# Altium schematic sheet mx8m_pmic.SchDoc (part 1 of 3)
size A2; SheetNumber: 3; SheetTotal: 15
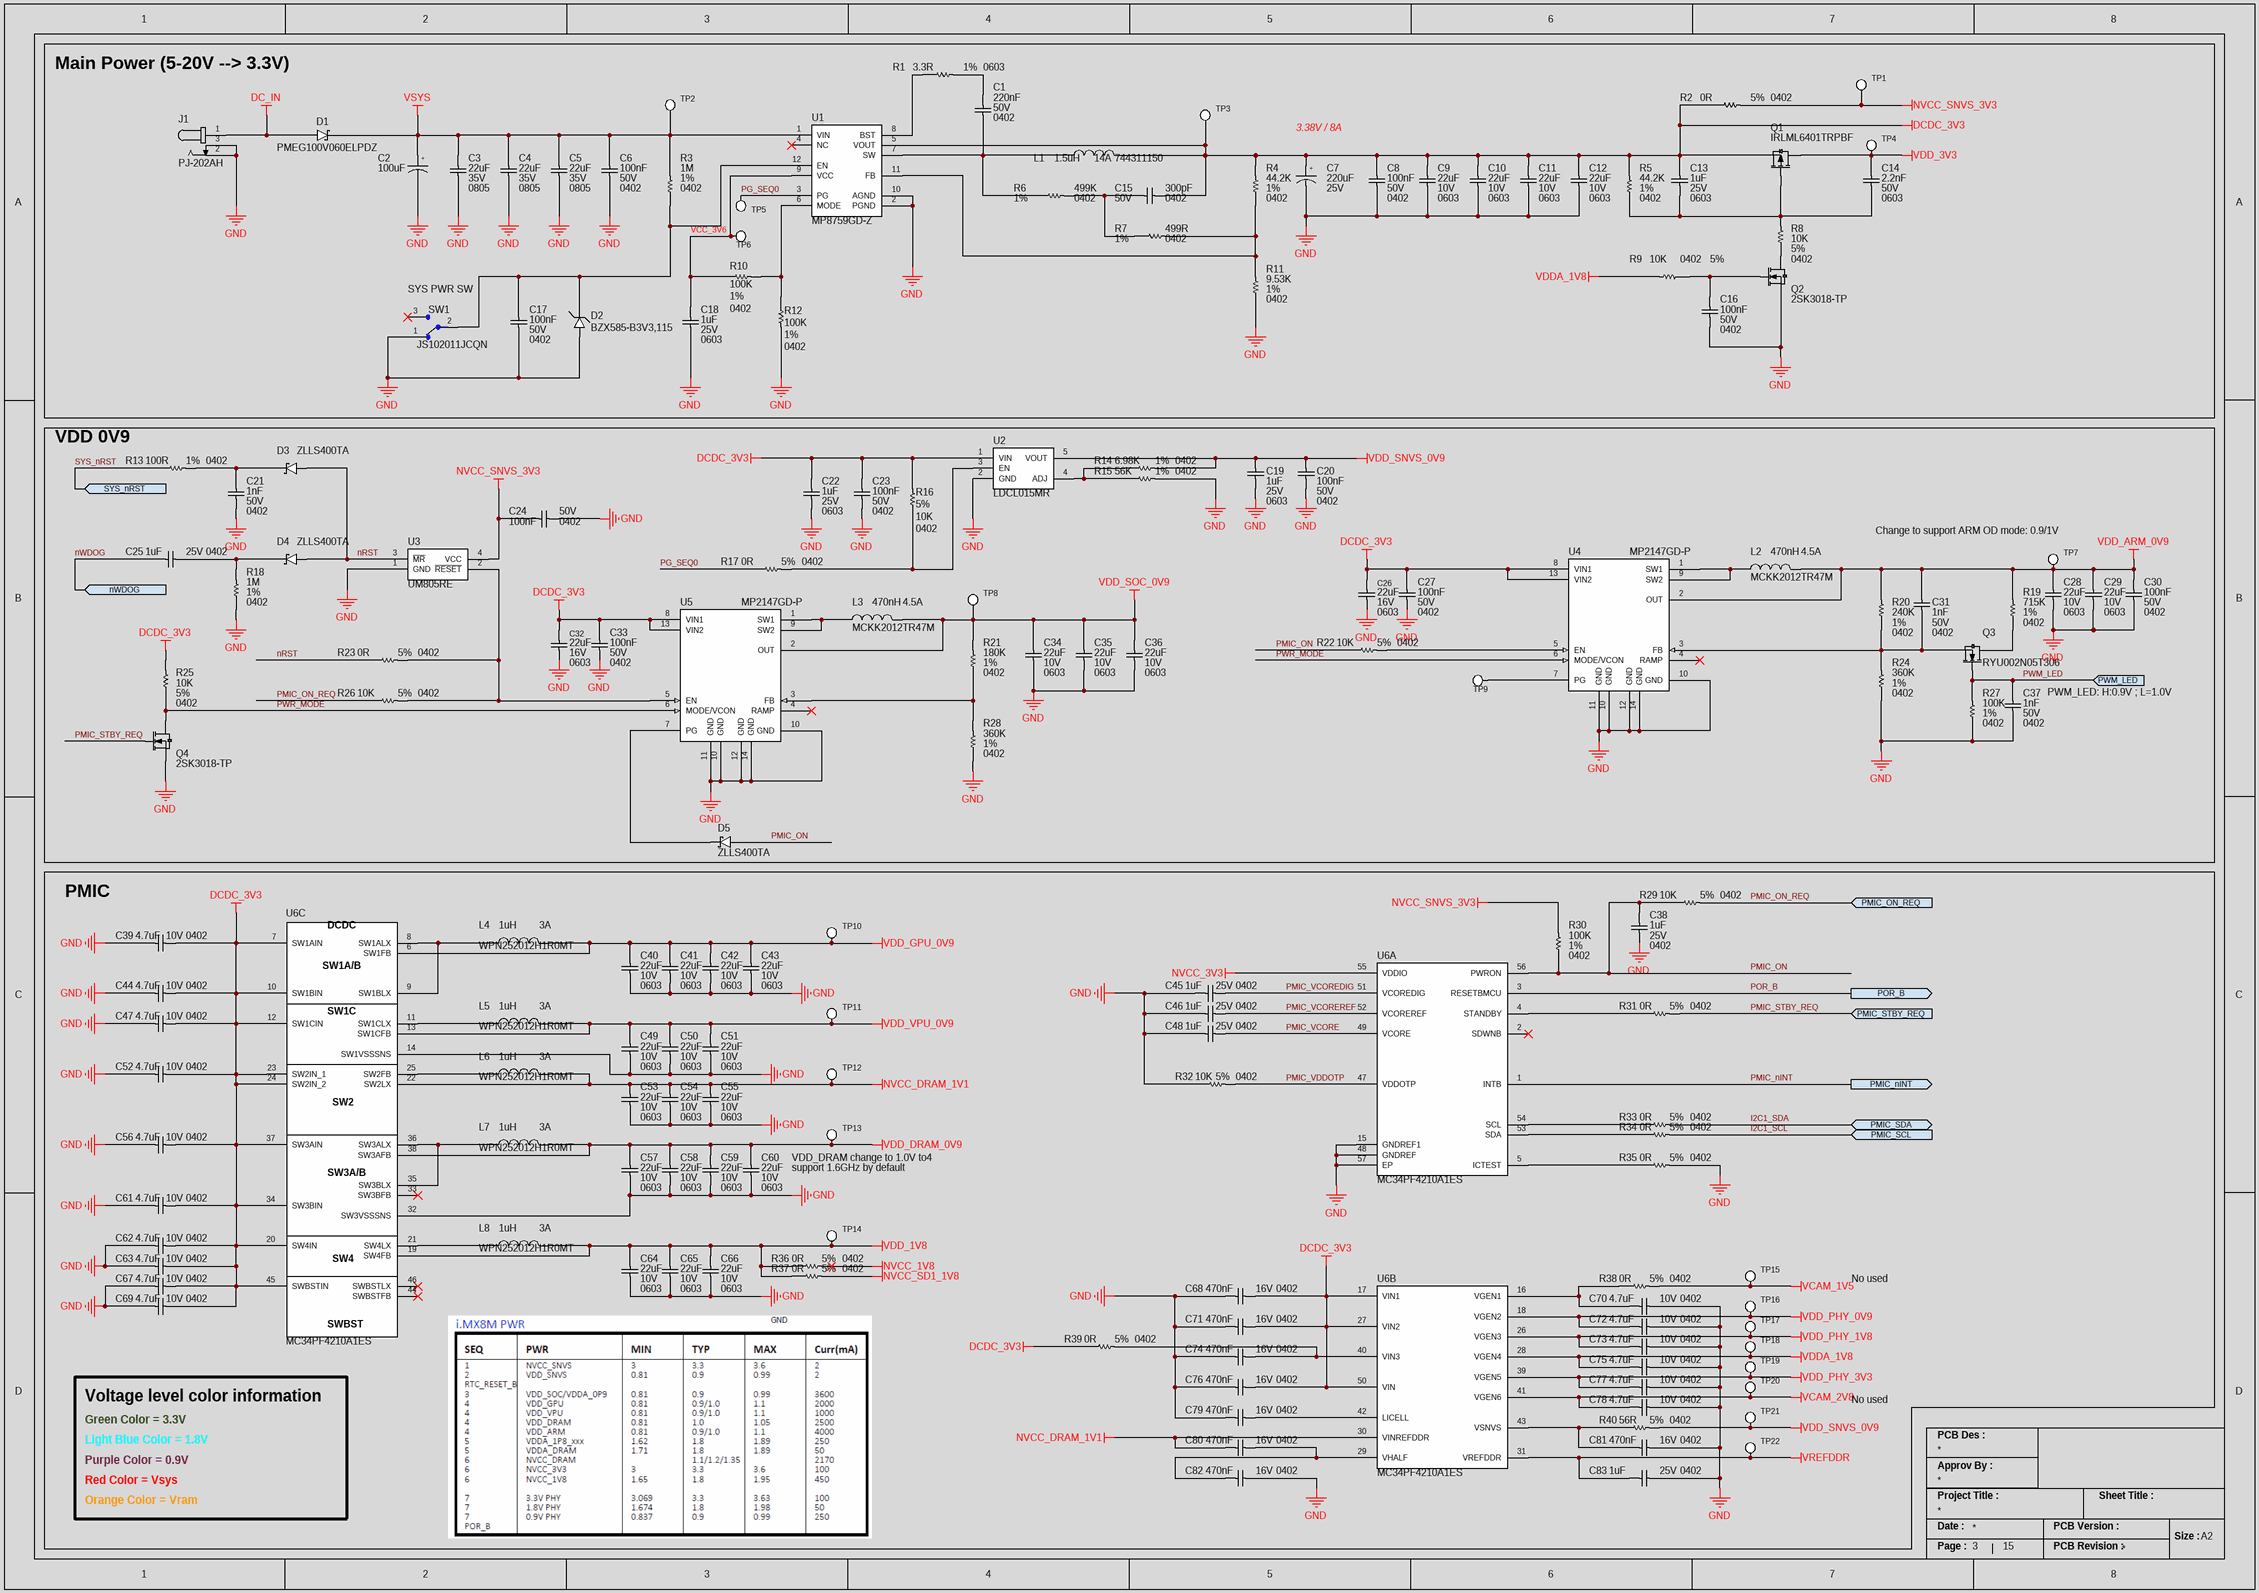
[diagram p0: mx8m_pmic.SchDoc]

## Parts
C1  Case/Package: 0402  Voltage Rating (DC): 50V  Capacitance: 220nF  [CAP_0402_CAPC1005X05N]  (hidden comment: GRM155R61H224KE01W)
C2  Capacitance: 100uF  [CAP_POLA_UD(8X10)]  (hidden comment: UUD1H101MNL1GS)
C3  Voltage rated: 35V  Case package: 0805  Capacitance: 22uF  [CAP_0805_CAPC2012X12N]  (hidden comment: C2012X5R1V226M125DC)
C4  Voltage rated: 35V  Case package: 0805  Capacitance: 22uF  [CAP_0805_CAPC2012X12N]  (hidden comment: C2012X5R1V226M125DC)
C5  Voltage rated: 35V  Case package: 0805  Capacitance: 22uF  [CAP_0805_CAPC2012X12N]  (hidden comment: C2012X5R1V226M125DC)
C6  Voltage Rating: 50V  Capacitance: 100nF  Case/Package: 0402  [CAP_0402_CAPC1005X05N]  (hidden comment: GRM155R71H104KE14D)
C7  Voltage Rating: 25V  Capacitance: 220uF  [CAP_POL_220uF_CAPAE830X1050N]  (hidden comment: EEV227M025A9MAA)
C8  Voltage Rating: 50V  Capacitance: 100nF  Case/Package: 0402  [CAP_0402_CAPC1005X05N]  (hidden comment: GRM155R71H104KE14D)
C9  Capacitance: 22uF  Voltage Rating: 10V  Case Code (Imperial): 0603  [CAP_0603_CAPC1608X08N]  (hidden comment: C1608X5R1A226M080AC)
C10  Capacitance: 22uF  Voltage Rating: 10V  Case Code (Imperial): 0603  [CAP_0603_CAPC1608X08N]  (hidden comment: C1608X5R1A226M080AC)
C11  Capacitance: 22uF  Voltage Rating: 10V  Case Code (Imperial): 0603  [CAP_0603_CAPC1608X08N]  (hidden comment: C1608X5R1A226M080AC)
C12  Capacitance: 22uF  Voltage Rating: 10V  Case Code (Imperial): 0603  [CAP_0603_CAPC1608X08N]  (hidden comment: C1608X5R1A226M080AC)
C13  Voltage Rating: 25V  Capacitance: 1uF  Case/Package: 0603  [CAP_0603_CAPC1608X08N]  (hidden comment: GCM188R71E105KA64D)
C14  Case/Package: 0603  Voltage Rating: 50V  Capacitance: 2.2nF  [CAP_0603_CAPC1608X08N]  (hidden comment: GRM1885C1H222JA01D)
C15  Case Code (Imperial): 0402  Voltage Rating: 50V  Capacitance: 300pF  [CAP_0402_CAPC1005X05N]  (hidden comment: GCM1555C1H301JA16D)
C16  Voltage Rating: 50V  Capacitance: 100nF  Case/Package: 0402  [CAP_0402_CAPC1005X05N]  (hidden comment: GRM155R71H104KE14D)
C17  Voltage Rating: 50V  Capacitance: 100nF  Case/Package: 0402  [CAP_0402_CAPC1005X05N]  (hidden comment: GRM155R71H104KE14D)
C18  Voltage Rating: 25V  Capacitance: 1uF  Case/Package: 0603  [CAP_0603_CAPC1608X08N]  (hidden comment: GCM188R71E105KA64D)
C19  Voltage Rating: 25V  Capacitance: 1uF  Case/Package: 0603  [CAP_0603_CAPC1608X08N]  (hidden comment: GCM188R71E105KA64D)
C20  Voltage Rating: 50V  Capacitance: 100nF  Case/Package: 0402  [CAP_0402_CAPC1005X05N]  (hidden comment: GRM155R71H104KE14D)
C21  Voltage Rating: 50V  Capacitance: 1nF  Case Code (Imperial): 0402  [CAP_0402_CAPC1005X05N]  (hidden comment: GRM1555C1H102JA01D)
C22  Voltage Rating: 25V  Capacitance: 1uF  Case/Package: 0603  [CAP_0603_CAPC1608X08N]  (hidden comment: GCM188R71E105KA64D)
C23  Voltage Rating: 50V  Capacitance: 100nF  Case/Package: 0402  [CAP_0402_CAPC1005X05N]  (hidden comment: GRM155R71H104KE14D)
C24  Voltage Rating: 50V  Capacitance: 100nF  Case/Package: 0402  [CAP_0402_CAPC1005X05N]  (hidden comment: GRM155R71H104KE14D)
C25  Voltage Rating: 25V  Capacitance: 1uF  Case Code (Imperial): 0402  [CAP_0402_CAPC1005X05N]  (hidden comment: GRM155R61E105KA12D)
C26  Capacitance: 22uF  Voltage Rating: 16V  Case/Package: 0603  [CAP_0603_CAPC1608X08N]  (hidden comment: CL10A226MO7JZNC)
C27  Voltage Rating: 50V  Capacitance: 100nF  Case/Package: 0402  [CAP_0402_CAPC1005X05N]  (hidden comment: GRM155R71H104KE14D)
C28  Capacitance: 22uF  Voltage Rating: 10V  Case Code (Imperial): 0603  [CAP_0603_CAPC1608X08N]  (hidden comment: C1608X5R1A226M080AC)
C29  Capacitance: 22uF  Voltage Rating: 10V  Case Code (Imperial): 0603  [CAP_0603_CAPC1608X08N]  (hidden comment: C1608X5R1A226M080AC)
C30  Voltage Rating: 50V  Capacitance: 100nF  Case/Package: 0402  [CAP_0402_CAPC1005X05N]  (hidden comment: GRM155R71H104KE14D)
C31  Voltage Rating: 50V  Capacitance: 1nF  Case Code (Imperial): 0402  [CAP_0402_CAPC1005X05N]  (hidden comment: GRM1555C1H102JA01D)
C32  Capacitance: 22uF  Voltage Rating: 16V  Case/Package: 0603  [CAP_0603_CAPC1608X08N]  (hidden comment: CL10A226MO7JZNC)
C33  Voltage Rating: 50V  Capacitance: 100nF  Case/Package: 0402  [CAP_0402_CAPC1005X05N]  (hidden comment: GRM155R71H104KE14D)
C34  Capacitance: 22uF  Voltage Rating: 10V  Case Code (Imperial): 0603  [CAP_0603_CAPC1608X08N]  (hidden comment: C1608X5R1A226M080AC)
C35  Capacitance: 22uF  Voltage Rating: 10V  Case Code (Imperial): 0603  [CAP_0603_CAPC1608X08N]  (hidden comment: C1608X5R1A226M080AC)
C36  Capacitance: 22uF  Voltage Rating: 10V  Case Code (Imperial): 0603  [CAP_0603_CAPC1608X08N]  (hidden comment: C1608X5R1A226M080AC)
C37  Voltage Rating: 50V  Capacitance: 1nF  Case Code (Imperial): 0402  [CAP_0402_CAPC1005X05N]  (hidden comment: GRM1555C1H102JA01D)
C38  Voltage Rating: 25V  Capacitance: 1uF  Case Code (Imperial): 0402  [CAP_0402_CAPC1005X05N]  (hidden comment: GRM155R61E105KA12D)
C39  Capacitance: 4.7uF  Voltage Rating: 10V  Case/Package: 0402  [CAP_0402_CAPC1005X05N]  (hidden comment: CL05A475KP5NRNC)
C40  Capacitance: 22uF  Voltage Rating: 10V  Case Code (Imperial): 0603  [CAP_0603_CAPC1608X08N]  (hidden comment: C1608X5R1A226M080AC)
C41  Capacitance: 22uF  Voltage Rating: 10V  Case Code (Imperial): 0603  [CAP_0603_CAPC1608X08N]  (hidden comment: C1608X5R1A226M080AC)
C42  Capacitance: 22uF  Voltage Rating: 10V  Case Code (Imperial): 0603  [CAP_0603_CAPC1608X08N]  (hidden comment: C1608X5R1A226M080AC)
C43  Capacitance: 22uF  Voltage Rating: 10V  Case Code (Imperial): 0603  [CAP_0603_CAPC1608X08N]  (hidden comment: C1608X5R1A226M080AC)
C44  Capacitance: 4.7uF  Voltage Rating: 10V  Case/Package: 0402  [CAP_0402_CAPC1005X05N]  (hidden comment: CL05A475KP5NRNC)
C45  Voltage Rating: 25V  Capacitance: 1uF  Case Code (Imperial): 0402  [CAP_0402_CAPC1005X05N]  (hidden comment: GRM155R61E105KA12D)
C46  Voltage Rating: 25V  Capacitance: 1uF  Case Code (Imperial): 0402  [CAP_0402_CAPC1005X05N]  (hidden comment: GRM155R61E105KA12D)
C47  Capacitance: 4.7uF  Voltage Rating: 10V  Case/Package: 0402  [CAP_0402_CAPC1005X05N]  (hidden comment: CL05A475KP5NRNC)
C48  Voltage Rating: 25V  Capacitance: 1uF  Case Code (Imperial): 0402  [CAP_0402_CAPC1005X05N]  (hidden comment: GRM155R61E105KA12D)
C49  Capacitance: 22uF  Voltage Rating: 10V  Case Code (Imperial): 0603  [CAP_0603_CAPC1608X08N]  (hidden comment: C1608X5R1A226M080AC)
C50  Capacitance: 22uF  Voltage Rating: 10V  Case Code (Imperial): 0603  [CAP_0603_CAPC1608X08N]  (hidden comment: C1608X5R1A226M080AC)
C51  Capacitance: 22uF  Voltage Rating: 10V  Case Code (Imperial): 0603  [CAP_0603_CAPC1608X08N]  (hidden comment: C1608X5R1A226M080AC)
C52  Capacitance: 4.7uF  Voltage Rating: 10V  Case/Package: 0402  [CAP_0402_CAPC1005X05N]  (hidden comment: CL05A475KP5NRNC)
C53  Capacitance: 22uF  Voltage Rating: 10V  Case Code (Imperial): 0603  [CAP_0603_CAPC1608X08N]  (hidden comment: C1608X5R1A226M080AC)
C54  Capacitance: 22uF  Voltage Rating: 10V  Case Code (Imperial): 0603  [CAP_0603_CAPC1608X08N]  (hidden comment: C1608X5R1A226M080AC)
C55  Capacitance: 22uF  Voltage Rating: 10V  Case Code (Imperial): 0603  [CAP_0603_CAPC1608X08N]  (hidden comment: C1608X5R1A226M080AC)
C56  Capacitance: 4.7uF  Voltage Rating: 10V  Case/Package: 0402  [CAP_0402_CAPC1005X05N]  (hidden comment: CL05A475KP5NRNC)
C57  Capacitance: 22uF  Voltage Rating: 10V  Case Code (Imperial): 0603  [CAP_0603_CAPC1608X08N]  (hidden comment: C1608X5R1A226M080AC)
C58  Capacitance: 22uF  Voltage Rating: 10V  Case Code (Imperial): 0603  [CAP_0603_CAPC1608X08N]  (hidden comment: C1608X5R1A226M080AC)
C59  Capacitance: 22uF  Voltage Rating: 10V  Case Code (Imperial): 0603  [CAP_0603_CAPC1608X08N]  (hidden comment: C1608X5R1A226M080AC)
C60  Capacitance: 22uF  Voltage Rating: 10V  Case Code (Imperial): 0603  [CAP_0603_CAPC1608X08N]  (hidden comment: C1608X5R1A226M080AC)
C61  Capacitance: 4.7uF  Voltage Rating: 10V  Case/Package: 0402  [CAP_0402_CAPC1005X05N]  (hidden comment: CL05A475KP5NRNC)
C62  Capacitance: 4.7uF  Voltage Rating: 10V  Case/Package: 0402  [CAP_0402_CAPC1005X05N]  (hidden comment: CL05A475KP5NRNC)
C63  Capacitance: 4.7uF  Voltage Rating: 10V  Case/Package: 0402  [CAP_0402_CAPC1005X05N]  (hidden comment: CL05A475KP5NRNC)
C64  Capacitance: 22uF  Voltage Rating: 10V  Case Code (Imperial): 0603  [CAP_0603_CAPC1608X08N]  (hidden comment: C1608X5R1A226M080AC)
C65  Capacitance: 22uF  Voltage Rating: 10V  Case Code (Imperial): 0603  [CAP_0603_CAPC1608X08N]  (hidden comment: C1608X5R1A226M080AC)
C66  Capacitance: 22uF  Voltage Rating: 10V  Case Code (Imperial): 0603  [CAP_0603_CAPC1608X08N]  (hidden comment: C1608X5R1A226M080AC)
C67  Capacitance: 4.7uF  Voltage Rating: 10V  Case/Package: 0402  [CAP_0402_CAPC1005X05N]  (hidden comment: CL05A475KP5NRNC)
C68  Voltage Rating: 16V  Capacitance: 470nF  Case/Package: 0402  [CAP_0402_CAPC1005X05N]  (hidden comment: GRT155R61C474KE01D)
C69  Capacitance: 4.7uF  Voltage Rating: 10V  Case/Package: 0402  [CAP_0402_CAPC1005X05N]  (hidden comment: CL05A475KP5NRNC)
C70  Capacitance: 4.7uF  Voltage Rating: 10V  Case/Package: 0402  [CAP_0402_CAPC1005X05N]  (hidden comment: CL05A475KP5NRNC)
C71  Voltage Rating: 16V  Capacitance: 470nF  Case/Package: 0402  [CAP_0402_CAPC1005X05N]  (hidden comment: GRT155R61C474KE01D)
C72  Capacitance: 4.7uF  Voltage Rating: 10V  Case/Package: 0402  [CAP_0402_CAPC1005X05N]  (hidden comment: CL05A475KP5NRNC)
C73  Capacitance: 4.7uF  Voltage Rating: 10V  Case/Package: 0402  [CAP_0402_CAPC1005X05N]  (hidden comment: CL05A475KP5NRNC)
C74  Voltage Rating: 16V  Capacitance: 470nF  Case/Package: 0402  [CAP_0402_CAPC1005X05N]  (hidden comment: GRT155R61C474KE01D)
C75  Capacitance: 4.7uF  Voltage Rating: 10V  Case/Package: 0402  [CAP_0402_CAPC1005X05N]  (hidden comment: CL05A475KP5NRNC)
C76  Voltage Rating: 16V  Capacitance: 470nF  Case/Package: 0402  [CAP_0402_CAPC1005X05N]  (hidden comment: GRT155R61C474KE01D)
C77  Capacitance: 4.7uF  Voltage Rating: 10V  Case/Package: 0402  [CAP_0402_CAPC1005X05N]  (hidden comment: CL05A475KP5NRNC)
C78  Capacitance: 4.7uF  Voltage Rating: 10V  Case/Package: 0402  [CAP_0402_CAPC1005X05N]  (hidden comment: CL05A475KP5NRNC)
C79  Voltage Rating: 16V  Capacitance: 470nF  Case/Package: 0402  [CAP_0402_CAPC1005X05N]  (hidden comment: GRT155R61C474KE01D)
C80  Voltage Rating: 16V  Capacitance: 470nF  Case/Package: 0402  [CAP_0402_CAPC1005X05N]  (hidden comment: GRT155R61C474KE01D)
C81  Voltage Rating: 16V  Capacitance: 470nF  Case/Package: 0402  [CAP_0402_CAPC1005X05N]  (hidden comment: GRT155R61C474KE01D)
C82  Voltage Rating: 16V  Capacitance: 470nF  Case/Package: 0402  [CAP_0402_CAPC1005X05N]  (hidden comment: GRT155R61C474KE01D)
C83  Voltage Rating: 25V  Capacitance: 1uF  Case Code (Imperial): 0402  [CAP_0402_CAPC1005X05N]  (hidden comment: GRM155R61E105KA12D)
D1  PMEG100V060ELPDZ  [DIO_SCKTY_PMEG060V100EPDAZ]
D2  BZX585-B3V3,115  [DIO_ZENER_BZX585B3V3115]
D3  ZLLS400TA  [DIO_SOD2512X113N]
D4  ZLLS400TA  [DIO_SOD2512X113N]
D5  ZLLS400TA  [DIO_SOD2512X113N]
J1  PJ-202AH  [CONN_CUI_PJ-202AH]
L1  744311150  Saturation Current: 14A  Inductance: 1.5uH  [IND_WE-HCI_7030/7040/705023]
L2  MCKK2012TR47M  Current Rating: 4.5A  Inductance: 470nH  [IND_0805_INDC2012X10N]
L3  MCKK2012TR47M  Current Rating: 4.5A  Inductance: 470nH  [IND_0805_INDC2012X10N]
L4  WPN252012H1R0MT  Current Rating: 3A  Inductance: 1uH  [IND_WPN252012H1R0MT]
L5  WPN252012H1R0MT  Current Rating: 3A  Inductance: 1uH  [IND_WPN252012H1R0MT]
L6  WPN252012H1R0MT  Current Rating: 3A  Inductance: 1uH  [IND_WPN252012H1R0MT]
L7  WPN252012H1R0MT  Current Rating: 3A  Inductance: 1uH  [IND_WPN252012H1R0MT]
L8  WPN252012H1R0MT  Current Rating: 3A  Inductance: 1uH  [IND_WPN252012H1R0MT]
Q1  IRLML6401TRPBF  [TRANS_FET_CH_P_SOT95P237X125-3N]
Q2  2SK3018-TP  [SOT-323]
Q3  RYU002N05T306  [SOT-323]
Q4  2SK3018-TP  [SOT-323]
R1  Tolerance: 1%  Resistance: 3.3R  Case Code (Imperial): 0603  [RES_0603_RESC1608X04N]  (hidden comment: RK73H1JTTD3R30F)
R2  Case Code (Imperial): 0402  Tolerance: 5%  Resistance: 0R  [RES_0402_RESC1005X04N]  (hidden comment: ERJ-2GE0R00X)
R3  Resistance: 1M  Tolerance: 1%  Case/Package: 0402  [RES_0402_RESC1005X04N]  (hidden comment: CR0402-FX-1004GLF)
R4  Case/Package: 0402  Tolerance: 1%  Resistance: 44.2K  [RES_0402_RESC1005X04N]  (hidden comment: ERJ-2RKF4422X)
R5  Case/Package: 0402  Tolerance: 1%  Resistance: 44.2K  [RES_0402_RESC1005X04N]  (hidden comment: ERJ-2RKF4422X)
R6  Resistance: 499K  Tolerance: 1%  Case/Package: 0402  [RES_0402_RESC1005X04N]  (hidden comment: ERJ-2RKF4993X)
R7  Tolerance: 1%  Resistance: 499R  Case/Package: 0402  [RES_0402_RESC1005X04N]  (hidden comment: ERJ-2RKF4990X)
R8  Tolerance: 5%  Resistance: 10K  Case/Package: 0402  [RES_0402_RESC1005X04N]  (hidden comment: ERJ-2GEJ103X)
R9  Tolerance: 5%  Resistance: 10K  Case/Package: 0402  [RES_0402_RESC1005X04N]  (hidden comment: ERJ-2GEJ103X)
R10  Resistance: 100K  Tolerance: 1%  Case/Package: 0402  [RES_0402_RESC1005X04N]  (hidden comment: RC0402FR-07100KL)
R11  Resistance: 9.53K  Tolerance: 1%  Case/Package: 0402  [RES_0402_RESC1005X04N]  (hidden comment: ERJ-2RKF9531X)
R12  Resistance: 100K  Tolerance: 1%  Case/Package: 0402  [RES_0402_RESC1005X04N]  (hidden comment: RC0402FR-07100KL)
R13  Tolerance: 1%  Resistance: 100R  Case/Package: 0402  [RES_0402_RESC1005X04N]  (hidden comment: ERJ-2RKF1000X)
R14  Resistance: 6.98K  Tolerance: 1%  Case/Package: 0402  [RES_0402_RESC1005X04N]  (hidden comment: RC0402FR-076K98L)
R15  Resistance: 56K  Tolerance: 1%  Case/Package: 0402  [RES_0402_RESC1005X04N]  (hidden comment: RK73H1ETTP5602F)
R16  Tolerance: 5%  Resistance: 10K  Case/Package: 0402  [RES_0402_RESC1005X04N]  (hidden comment: ERJ-2GEJ103X)
R17  Case Code (Imperial): 0402  Tolerance: 5%  Resistance: 0R  [RES_0402_RESC1005X04N]  (hidden comment: ERJ-2GE0R00X)
R18  Resistance: 1M  Tolerance: 1%  Case/Package: 0402  [RES_0402_RESC1005X04N]  (hidden comment: CR0402-FX-1004GLF)
R19  Tolerance: 1%  Resistance: 715K  Case/Package: 0402  [RES_0402_RESC1005X04N]  (hidden comment: RK73H1ETTP7153F)
R20  Tolerance: 1%  Resistance: 240K  Case/Package: 0402  [RES_0402_RESC1005X04N]  (hidden comment: CR0402-FX-2403GLF)
R21  Tolerance: 1%  Resistance: 180K  Case/Package: 0402  [RES_0402_RESC1005X04N]  (hidden comment: RK73H1ETTP1803F)
R22  Tolerance: 5%  Resistance: 10K  Case/Package: 0402  [RES_0402_RESC1005X04N]  (hidden comment: ERJ-2GEJ103X)
R23  Case Code (Imperial): 0402  Tolerance: 5%  Resistance: 0R  [RES_0402_RESC1005X04N]  (hidden comment: ERJ-2GE0R00X)
R24  Tolerance: 1%  Resistance: 360K  Case/Package: 0402  [RES_0402_RESC1005X04N]  (hidden comment: RK73H1ETTP3603F)
R25  Tolerance: 5%  Resistance: 10K  Case/Package: 0402  [RES_0402_RESC1005X04N]  (hidden comment: ERJ-2GEJ103X)
R26  Tolerance: 5%  Resistance: 10K  Case/Package: 0402  [RES_0402_RESC1005X04N]  (hidden comment: ERJ-2GEJ103X)
R27  Resistance: 100K  Tolerance: 1%  Case/Package: 0402  [RES_0402_RESC1005X04N]  (hidden comment: RC0402FR-07100KL)
R28  Tolerance: 1%  Resistance: 360K  Case/Package: 0402  [RES_0402_RESC1005X04N]  (hidden comment: RK73H1ETTP3603F)
R29  Tolerance: 5%  Resistance: 10K  Case/Package: 0402  [RES_0402_RESC1005X04N]  (hidden comment: ERJ-2GEJ103X)
R30  Resistance: 100K  Tolerance: 1%  Case/Package: 0402  [RES_0402_RESC1005X04N]  (hidden comment: RC0402FR-07100KL)
R31  Case Code (Imperial): 0402  Tolerance: 5%  Resistance: 0R  [RES_0402_RESC1005X04N]  (hidden comment: ERJ-2GE0R00X)
R32  Tolerance: 5%  Resistance: 10K  Case/Package: 0402  [RES_0402_RESC1005X04N]  (hidden comment: ERJ-2GEJ103X)
R33  Case Code (Imperial): 0402  Tolerance: 5%  Resistance: 0R  [RES_0402_RESC1005X04N]  (hidden comment: ERJ-2GE0R00X)
R34  Case Code (Imperial): 0402  Tolerance: 5%  Resistance: 0R  [RES_0402_RESC1005X04N]  (hidden comment: ERJ-2GE0R00X)
R35  Case Code (Imperial): 0402  Tolerance: 5%  Resistance: 0R  [RES_0402_RESC1005X04N]  (hidden comment: ERJ-2GE0R00X)
R36  Case Code (Imperial): 0402  Tolerance: 5%  Resistance: 0R  [RES_0402_RESC1005X04N]  (hidden comment: ERJ-2GE0R00X)
R37  Case Code (Imperial): 0402  Tolerance: 5%  Resistance: 0R  [RES_0402_RESC1005X04N]  (hidden comment: ERJ-2GE0R00X)
R38  Case Code (Imperial): 0402  Tolerance: 5%  Resistance: 0R  [RES_0402_RESC1005X04N]  (hidden comment: ERJ-2GE0R00X)
R39  Case Code (Imperial): 0402  Tolerance: 5%  Resistance: 0R  [RES_0402_RESC1005X04N]  (hidden comment: ERJ-2GE0R00X)
R40  Resistance: 56R  Tolerance: 5%  Case/Package: 0402  [RES_0402_RESC1005X04N]  (hidden comment: CRCW040256R0JNED)
SW1  JS102011JCQN  [SW_JS102011JCQN]
TP1  NO COMPONENT  [TP_PAD_1.6MM_SMD_ROUND]  (value not drawn)  (no BOM)
TP2  NO COMPONENT  [TP_PAD_1.6MM_SMD_ROUND]  (value not drawn)  (no BOM)
TP3  NO COMPONENT  [TP_PAD_1.6MM_SMD_ROUND]  (value not drawn)  (no BOM)
TP4  NO COMPONENT  [TP_PAD_1.6MM_SMD_ROUND]  (value not drawn)  (no BOM)
TP5  NO COMPONENT  [TP_PAD_1.6MM_SMD_ROUND]  (value not drawn)  (no BOM)
TP6  NO COMPONENT  [TP_PAD_1.6MM_SMD_ROUND]  (value not drawn)  (no BOM)
TP7  NO COMPONENT  [TP_PAD_1.6MM_SMD_ROUND]  (value not drawn)  (no BOM)
TP8  NO COMPONENT  [TP_PAD_1.6MM_SMD_ROUND]  (value not drawn)  (no BOM)
TP9  NO COMPONENT  [TP_PAD_1.6MM_SMD_ROUND]  (value not drawn)  (no BOM)
TP10  NO COMPONENT  [TP_PAD_1.6MM_SMD_ROUND]  (value not drawn)  (no BOM)
TP11  NO COMPONENT  [TP_PAD_1.6MM_SMD_ROUND]  (value not drawn)  (no BOM)
TP12  NO COMPONENT  [TP_PAD_1.6MM_SMD_ROUND]  (value not drawn)  (no BOM)
TP13  NO COMPONENT  [TP_PAD_1.6MM_SMD_ROUND]  (value not drawn)  (no BOM)
TP14  NO COMPONENT  [TP_PAD_1.6MM_SMD_ROUND]  (value not drawn)  (no BOM)
TP15  NO COMPONENT  [TP_PAD_1.6MM_SMD_ROUND]  (value not drawn)  (no BOM)
TP16  NO COMPONENT  [TP_PAD_1.6MM_SMD_ROUND]  (value not drawn)  (no BOM)
TP17  NO COMPONENT  [TP_PAD_1.6MM_SMD_ROUND]  (value not drawn)  (no BOM)
TP18  NO COMPONENT  [TP_PAD_1.6MM_SMD_ROUND]  (value not drawn)  (no BOM)
TP19  NO COMPONENT  [TP_PAD_1.6MM_SMD_ROUND]  (value not drawn)  (no BOM)
TP20  NO COMPONENT  [TP_PAD_1.6MM_SMD_ROUND]  (value not drawn)  (no BOM)
TP21  NO COMPONENT  [TP_PAD_1.6MM_SMD_ROUND]  (value not drawn)  (no BOM)
TP22  NO COMPONENT  [TP_PAD_1.6MM_SMD_ROUND]  (value not drawn)  (no BOM)
U1  MP8759GD-Z  [IC_REG_MP8759GDZ]
U2  LDCL015MR  [IC_REG_SOT95P280X145-5N]
U3  UM805RE  [IC_SUP_VOL_UM805RE]
U4  MP2147GD-P  [IC_REG_MP2147GDP]
U5  MP2147GD-P  [IC_REG_MP2147GDP]
U6  MC34PF4210A1ES  [IC_PMIC_QFN50P800X800X90-57N-D]  (parts A,B,C of 3)

## Blocks framed on the sheet
Main Power (5-20V --> 3.3V): C1-C18 D1 D2 J1 L1 Q1 Q2 R1-R12 SW1 TP1-TP6 U1
VDD 0V9: C19-C37 D3-D5 L2 L3 Q3 Q4 R13-R28 TP7-TP9 U2-U5

## Ports
nWDOG (in), PMIC_nINT (out), PMIC_ON_REQ (in), PMIC_SCL (in), PMIC_SDA (bidir), PMIC_STBY_REQ (in), POR_B (out), PWM_LED (in), SYS_nRST (in)

## Nets
DC_IN: D1.A J1.1
DCDC_3V3: C7.1 C8.1 C9.2 C10.2 C11.2 C12.2 C13.2 C15.2 C22.2 C23.1 C26.2 C27.1 C32.2 C33.1 C39.2 C44.2 C47.2 C52.2 C56.2 C61.2 C62.2 C63.2 C67.2 C68.2 C69.2 C71.2 C76.2 L1.2 Q1.2(S) R2.1 R4.2 R5.2 R16.2 R25.2 R39.1 TP3.1 U1.5(VOUT) U2.1(VIN) U4.8(VIN1) U4.13(VIN2) U5.8(VIN1) U5.13(VIN2) U6.7(SW1AIN) U6.10(SW1BIN) U6.12(SW1CIN) U6.17(VIN1) U6.20(SW4IN) U6.23(SW2IN_1) U6.24(SW2IN_2) U6.27(VIN2) U6.34(SW3BIN) U6.37(SW3AIN) U6.45(SWBSTIN) U6.50(VIN)
GND: C2.2 C3.1 C4.1 C5.1 C6.1 C7.2 C8.2 C9.1 C10.1 C11.1 C12.1 C16.2 C17.1 C18.1 C19.1 C20.2 C21.1 C22.1 C23.2 C24.2 C26.1 C27.2 C28.1 C29.1 C30.2 C32.1 C33.2 C34.1 C35.1 C36.1 C37.1 C38.1 C39.1 C40.1 C41.1 C42.1 C43.1 C44.1 C45.1 C46.1 C47.1 C48.1 C49.1 C50.1 C51.1 C52.1 C53.1 C54.1 C55.1 C56.1 C57.1 C58.1 C59.1 C60.1 C61.1 C62.1 C63.1 C64.1 C65.1 C66.1 C67.1 C68.1 C69.1 C70.2 C71.1 C72.2 C73.2 C74.1 C75.2 C76.1 C77.2 C78.2 C79.1 C81.2 C82.2 C83.1 D2.2(A) J1.2 J1.3 Q2.S Q4.S R11.1 R12.2 R15.2 R18.1 R24.1 R27.1 R28.1 R32.1 R35.2 SW1.1 U1.2(PGND) U1.10(AGND) U2.2(GND) U3.1(GND) U4.10(GND) U4.11(GND) U4.12(GND) U4.14(GND) U5.10(GND) U5.11(GND) U5.12(GND) U5.14(GND) U6.14(SW1VSSSNS) U6.15(GNDREF1) U6.32(SW3VSSSNS) U6.48(GNDREF) U6.57(EP)
NVCC_1V8: R36.2
NVCC_3V3: U6.55(VDDIO)
NVCC_DRAM_1V1: C53.2 C54.2 C55.2 C80.1 L6.2 TP12.1 U6.22(SW2LX) U6.30(VINREFDDR)
NVCC_SD1_1V8: R37.2
NVCC_SNVS_3V3: C24.1 R2.2 R30.2 TP1.1 U3.4(VCC)
VCAM_1V5: R38.2 TP15.1
VCAM_2V8: C78.1 TP20.1 U6.41(VGEN6)
VDD_1V8: C64.2 C65.2 C66.2 L8.2 R36.1 R37.1 TP14.1 U6.19(SW4FB)
VDD_3V3: C14.2 Q1.3(D) TP4.1
VDD_ARM_0V9: C28.2 C29.2 C30.1 C31.2 L2.2 R19.2 R20.2 TP7.1 U4.2(OUT)
VDD_DRAM_0V9: C57.2 C58.2 C59.2 C60.2 L7.2 TP13.1 U6.38(SW3AFB)
VDD_GPU_0V9: C40.2 C41.2 C42.2 C43.2 L4.2 TP10.1 U6.6(SW1FB)
VDD_PHY_0V9: C72.1 TP16.1 U6.18(VGEN2)
VDD_PHY_1V8: C73.1 TP17.1 U6.26(VGEN3)
VDD_PHY_3V3: C77.1 TP19.1 U6.39(VGEN5)
VDD_SNVS_0V9: C19.2 C20.1 R14.2 R40.2 TP21.1 U2.5(VOUT)
VDD_SOC_0V9: C34.2 C35.2 C36.2 L3.2 R21.2 TP8.1 U5.2(OUT)
VDD_VPU_0V9: C49.2 C50.2 C51.2 L5.2 TP11.1 U6.13(SW1CFB)
VDDA_1V8: C75.1 R9.2 TP18.1 U6.28(VGEN4)
VREFDDR: C83.2 TP22.1 U6.31(VREFDDR)
VSYS: C2.1 C3.2 C4.2 C5.2 C6.2 D1.K R3.2 TP2.1 U1.1(VIN)
I2C1_SCL: R34.2 ; port PMIC_SCL
I2C1_SDA: R33.2 ; port PMIC_SDA
nRST: D3.2(A) D4.2(A) R23.1 U3.3(~{MR})
nWDOG: C25.1 ; port nWDOG
PG_SEQ0: R17.1 TP5.1 U1.3(PG)
PMIC_nINT: U6.1(INTB) ; port PMIC_nINT
PMIC_ON: C38.2 D5.2(A) R22.1 R29.1 R30.1 U6.56(PWRON)
PMIC_ON_REQ: R26.1 R29.2 ; port PMIC_ON_REQ
PMIC_STBY_REQ: Q4.G R31.2 ; port PMIC_STBY_REQ
PMIC_VCORE: C48.2 U6.49(VCORE)
PMIC_VCOREDIG: C45.2 U6.51(VCOREDIG)
PMIC_VCOREREF: C46.2 U6.52(VCOREREF)
PMIC_VDDOTP: R32.2 U6.47(VDDOTP)
POR_B: U6.3(RESETBMCU) ; port POR_B
PWM_LED: C37.2 Q3.G R27.2 ; port PWM_LED
PWR_MODE: Q4.D R25.1 U4.6(MODE/VCON) U5.6(MODE/VCON)
SYS_nRST: R13.1 ; port SYS_nRST
VCC_3V6: C18.2 R10.1 TP6.1 U1.9(VCC)
NetC1_1: C1.1 L1.1 R6.1 U1.7(SW)
NetC1_2: C1.2 R1.2
NetC13_1: C13.1 C14.1 Q1.1(G) R5.1 R8.2
NetC15_1: C15.1 R6.2 R7.1
NetC16_1: C16.1 Q2.G R9.1
NetC17_2: C17.2 D2.1(K) R3.1 SW1.2 U1.12(EN)
NetC21_2: C21.2 D3.1(K) R13.2
NetC25_2: C25.2 D4.1(K) R18.2
NetC31_1: C31.1 Q3.S R20.1 R24.2 U4.3(FB)
NetC70_1: C70.1 R38.1 U6.16(VGEN1)
NetC74_2: C74.2 R39.2 U6.40(VIN3)
NetC79_2: C79.2 U6.42(LICELL)
NetC80_2: C80.2 C82.1 U6.29(VHALF)
NetC81_1: C81.1 R40.1 U6.43(VSNVS)
NetD5_1: D5.1(K) U5.7(PG)
NetL2_1: L2.1 U4.1(SW1) U4.9(SW2)
NetL3_1: L3.1 U5.1(SW1) U5.9(SW2)
NetL4_1: L4.1 U6.8(SW1ALX) U6.9(SW1BLX)
NetL5_1: L5.1 U6.11(SW1CLX)
NetL6_1: L6.1 U6.25(SW2FB)
NetL7_1: L7.1 U6.35(SW3BLX) U6.36(SW3ALX)
NetL8_1: L8.1 U6.21(SW4LX)
NetQ2_D: Q2.D R8.1
NetQ3_D: Q3.D R19.1
NetR1_1: R1.1 U1.8(BST)
NetR4_1: R4.1 R7.2 R11.2 U1.11(FB)
NetR10_2: R10.2 R12.1 U1.6(MODE)
NetR14_1: R14.1 R15.1 U2.4(ADJ)
NetR16_1: R16.1 R17.2 U2.3(EN)
NetR21_1: R21.1 R28.2 U5.3(FB)
NetR22_2: R22.2 U4.5(EN)
NetR23_2: R23.2 R26.2 U3.2(~{RESET}) U5.5(EN)
NetR31_1: R31.1 U6.4(STANDBY)
NetR33_1: R33.1 U6.54(SCL)
NetR34_1: R34.1 U6.53(SDA)
NetR35_1: R35.1 U6.5(ICTEST)
NetTP9_1: TP9.1 U4.7(PG)

Not connected (* = marked no-connect by the designer): SW1 3*; U1 4(NC)*; U4 4(RAMP)*; U5 4(RAMP)*; U6 2(SDWNB)* 33(SW3BFB)* 44(SWBSTFB)* 46(SWBSTLX)*

## Notes on the sheet
- 3.38V / 8A
- (near SW1) SYS PWR SW
- (near TP7) Change to support ARM OD mode: 0.9/1V
- (near C37) PWM_LED: H:0.9V ; L=1.0V
- PMIC
- (near TP13) VDD_DRAM change to 1.0V to4
- (near TP13) support 1.6GHz by default
- No used
- Voltage level color information
- Green Color = 3.3V
- Light Blue Color = 1.8V
- Purple Color = 0.9V
- Red Color = Vsys
- Orange Color = Vram
- PCB Des :
- Approv By :
- Project Title :
- Sheet Title :
- Date :
- Page :
- PCB Version :
- PCB Revision :
- Size :
- A2
- (in symbol CAP_100UF_50V_POL) +
- (in symbol CAP_220uF_EEV227M025A9MAA) +
- (in symbol IC_PMIC_NXP_MC34PF4210A1ES, part C) DCDC; SW1A/B; SW1C; SW2; SW3A/B; SW4; SWBST